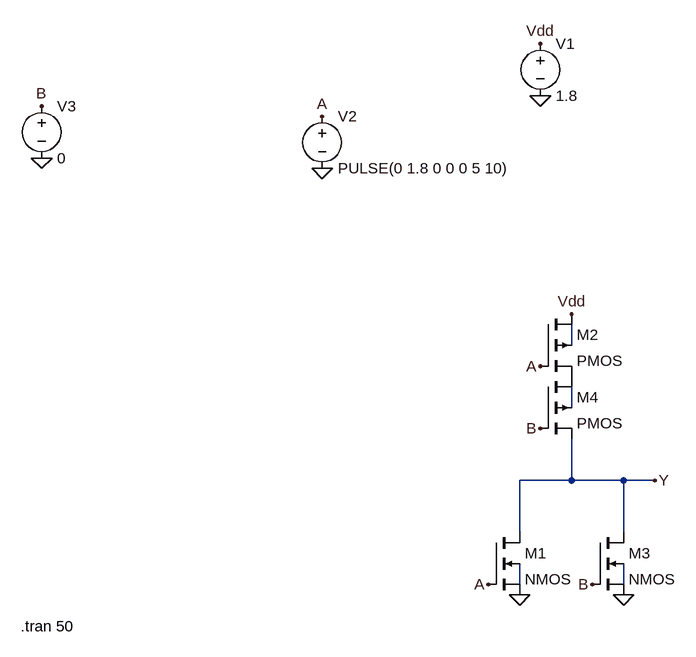
[diagram p0: schematic NOR.asc]
NOR.asc, the LTspice schematic file:
Version 4
SHEET 1 880 680
WIRE 80 32 80 0
WIRE 80 128 80 96
WIRE 80 240 80 176
WIRE 80 240 0 240
WIRE 160 240 80 240
WIRE 208 240 160 240
WIRE 0 320 0 240
WIRE 160 320 160 240
WIRE 0 400 0 368
WIRE 160 400 160 368
FLAG 32 -432 Vdd
FLAG 32 -352 0
FLAG -304 -320 A
FLAG -304 -240 0
FLAG 160 416 0
FLAG 80 -16 Vdd
FLAG -736 -336 B
FLAG -736 -256 0
FLAG 32 64 A
FLAG -48 400 A
FLAG 32 160 B
FLAG 112 400 B
FLAG 208 240 Y
FLAG 0 416 0
SYMBOL nmos4 -48 320 R0
SYMATTR InstName M1
SYMATTR Value2 l=0.13u w=0.13u
SYMBOL pmos4 32 -16 R0
SYMATTR InstName M2
SYMATTR Value2 l=0.13u w=0.13u
SYMBOL voltage 32 -448 R0
WINDOW 123 0 0 Left 0
WINDOW 39 0 0 Left 0
SYMATTR InstName V1
SYMATTR Value 1.8
SYMBOL voltage -304 -336 R0
WINDOW 123 0 0 Left 0
WINDOW 39 0 0 Left 0
SYMATTR InstName V2
SYMATTR Value PULSE(0 1.8 0 0 0 5 10)
SYMBOL nmos4 112 320 R0
SYMATTR InstName M3
SYMATTR Value2 l=0.13u w=0.13u
SYMBOL pmos4 32 80 R0
SYMATTR InstName M4
SYMATTR Value2 l=0.13u w=0.13u
SYMBOL voltage -736 -352 R0
WINDOW 123 0 0 Left 0
WINDOW 39 0 0 Left 0
SYMATTR InstName V3
SYMATTR Value 0
TEXT -768 464 Left 2 !.tran 50

The netlist it stands for:
* NOR.asc
M1 Y A 0 N003 NMOS l=0.13u w=0.13u
M2 Vdd A P001 N001 PMOS l=0.13u w=0.13u
V1 Vdd 0 1.8
V2 A 0 PULSE(0 1.8 0 0 0 5 10)
M3 Y B 0 N004 NMOS l=0.13u w=0.13u
M4 P001 B Y N002 PMOS l=0.13u w=0.13u
V3 B 0 0
.model NMOS NMOS
.model PMOS PMOS
.lib standard.mos
.tran 50
.backanno
.end